# Altium project Ai-WB2-01S推荐封装.PrjPcb
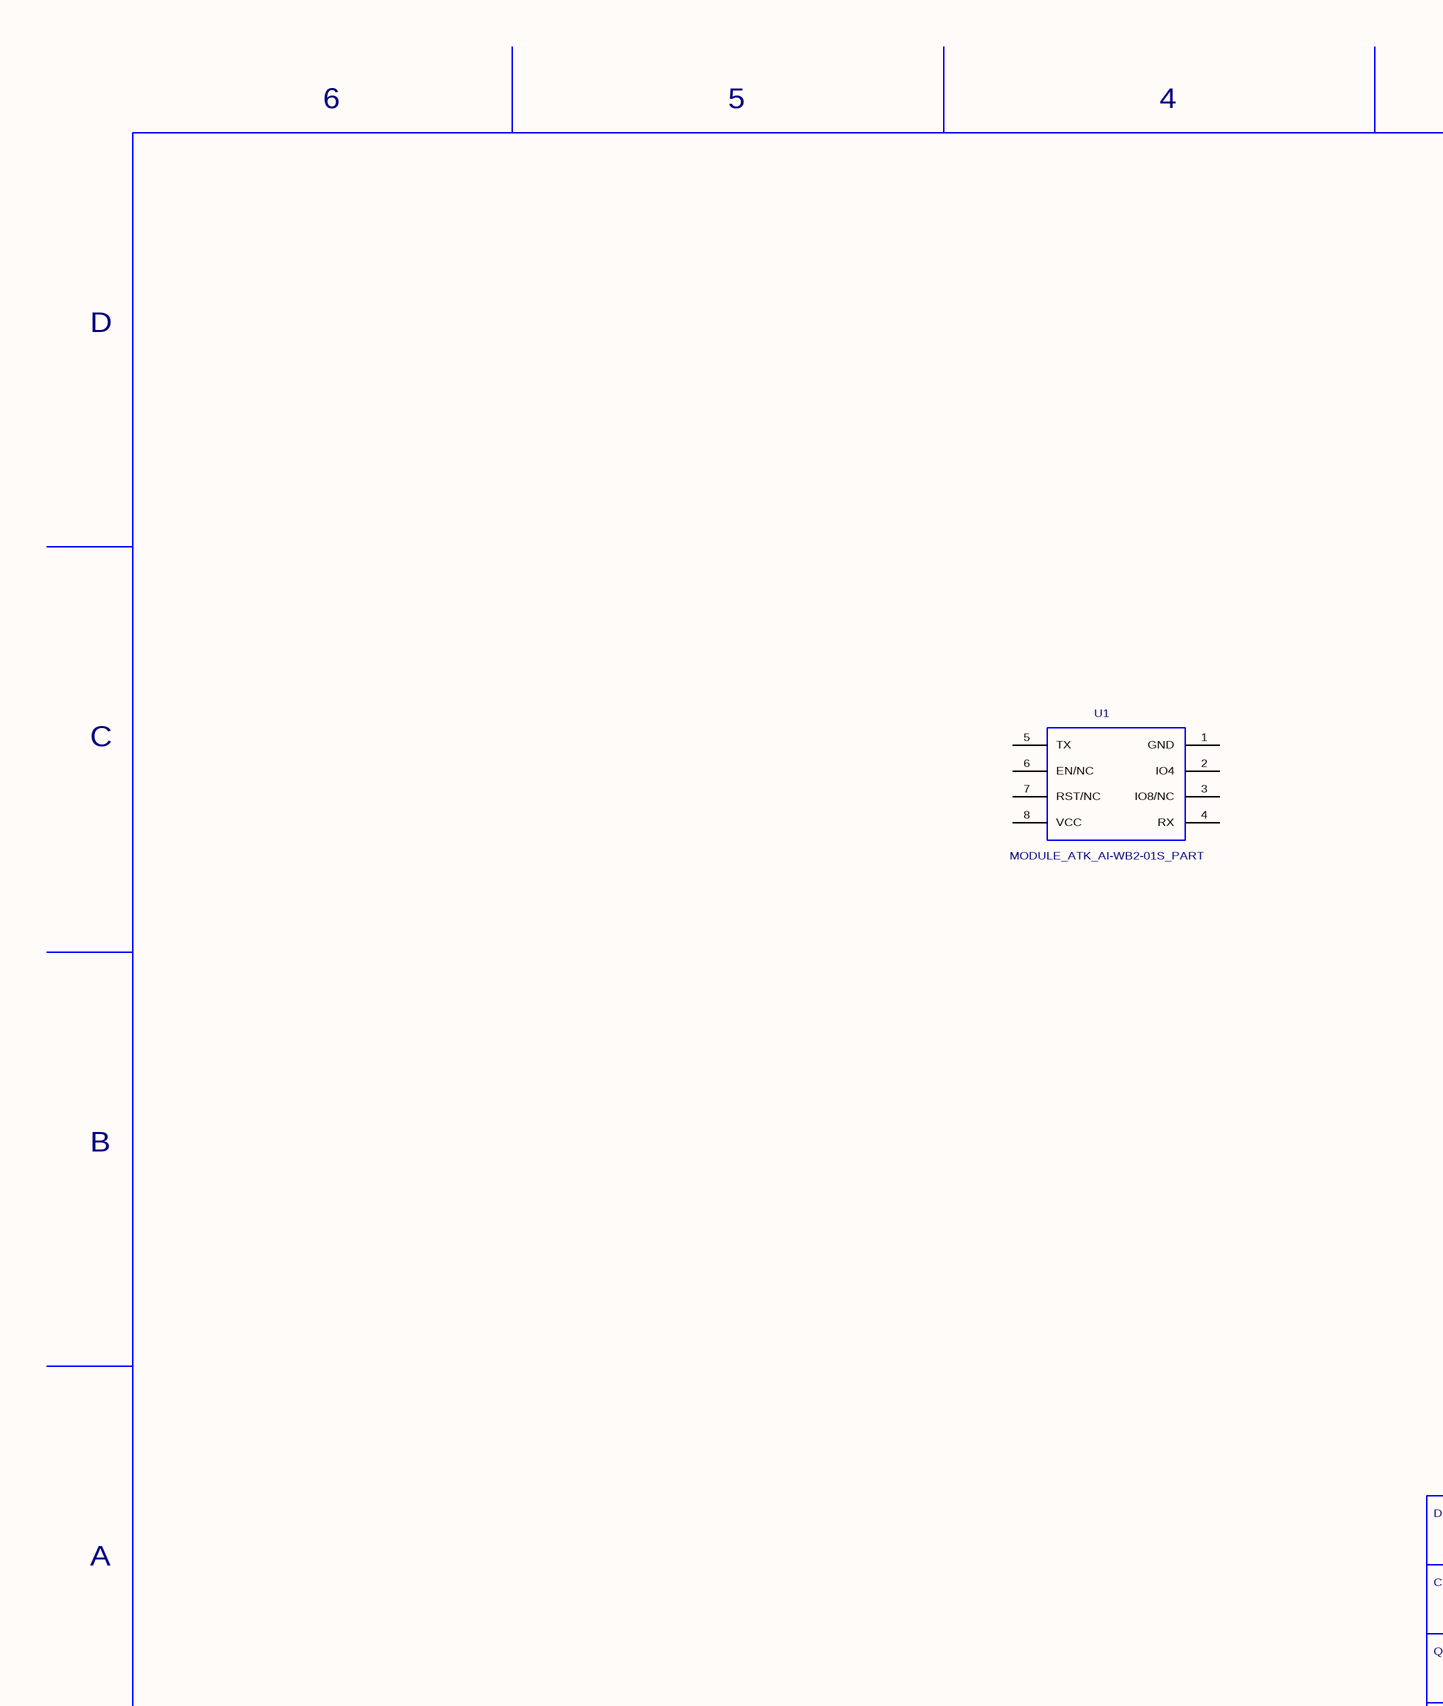
[diagram p0: Ai-WB2-01S推荐封装.Sheet 1.SchDoc, left]
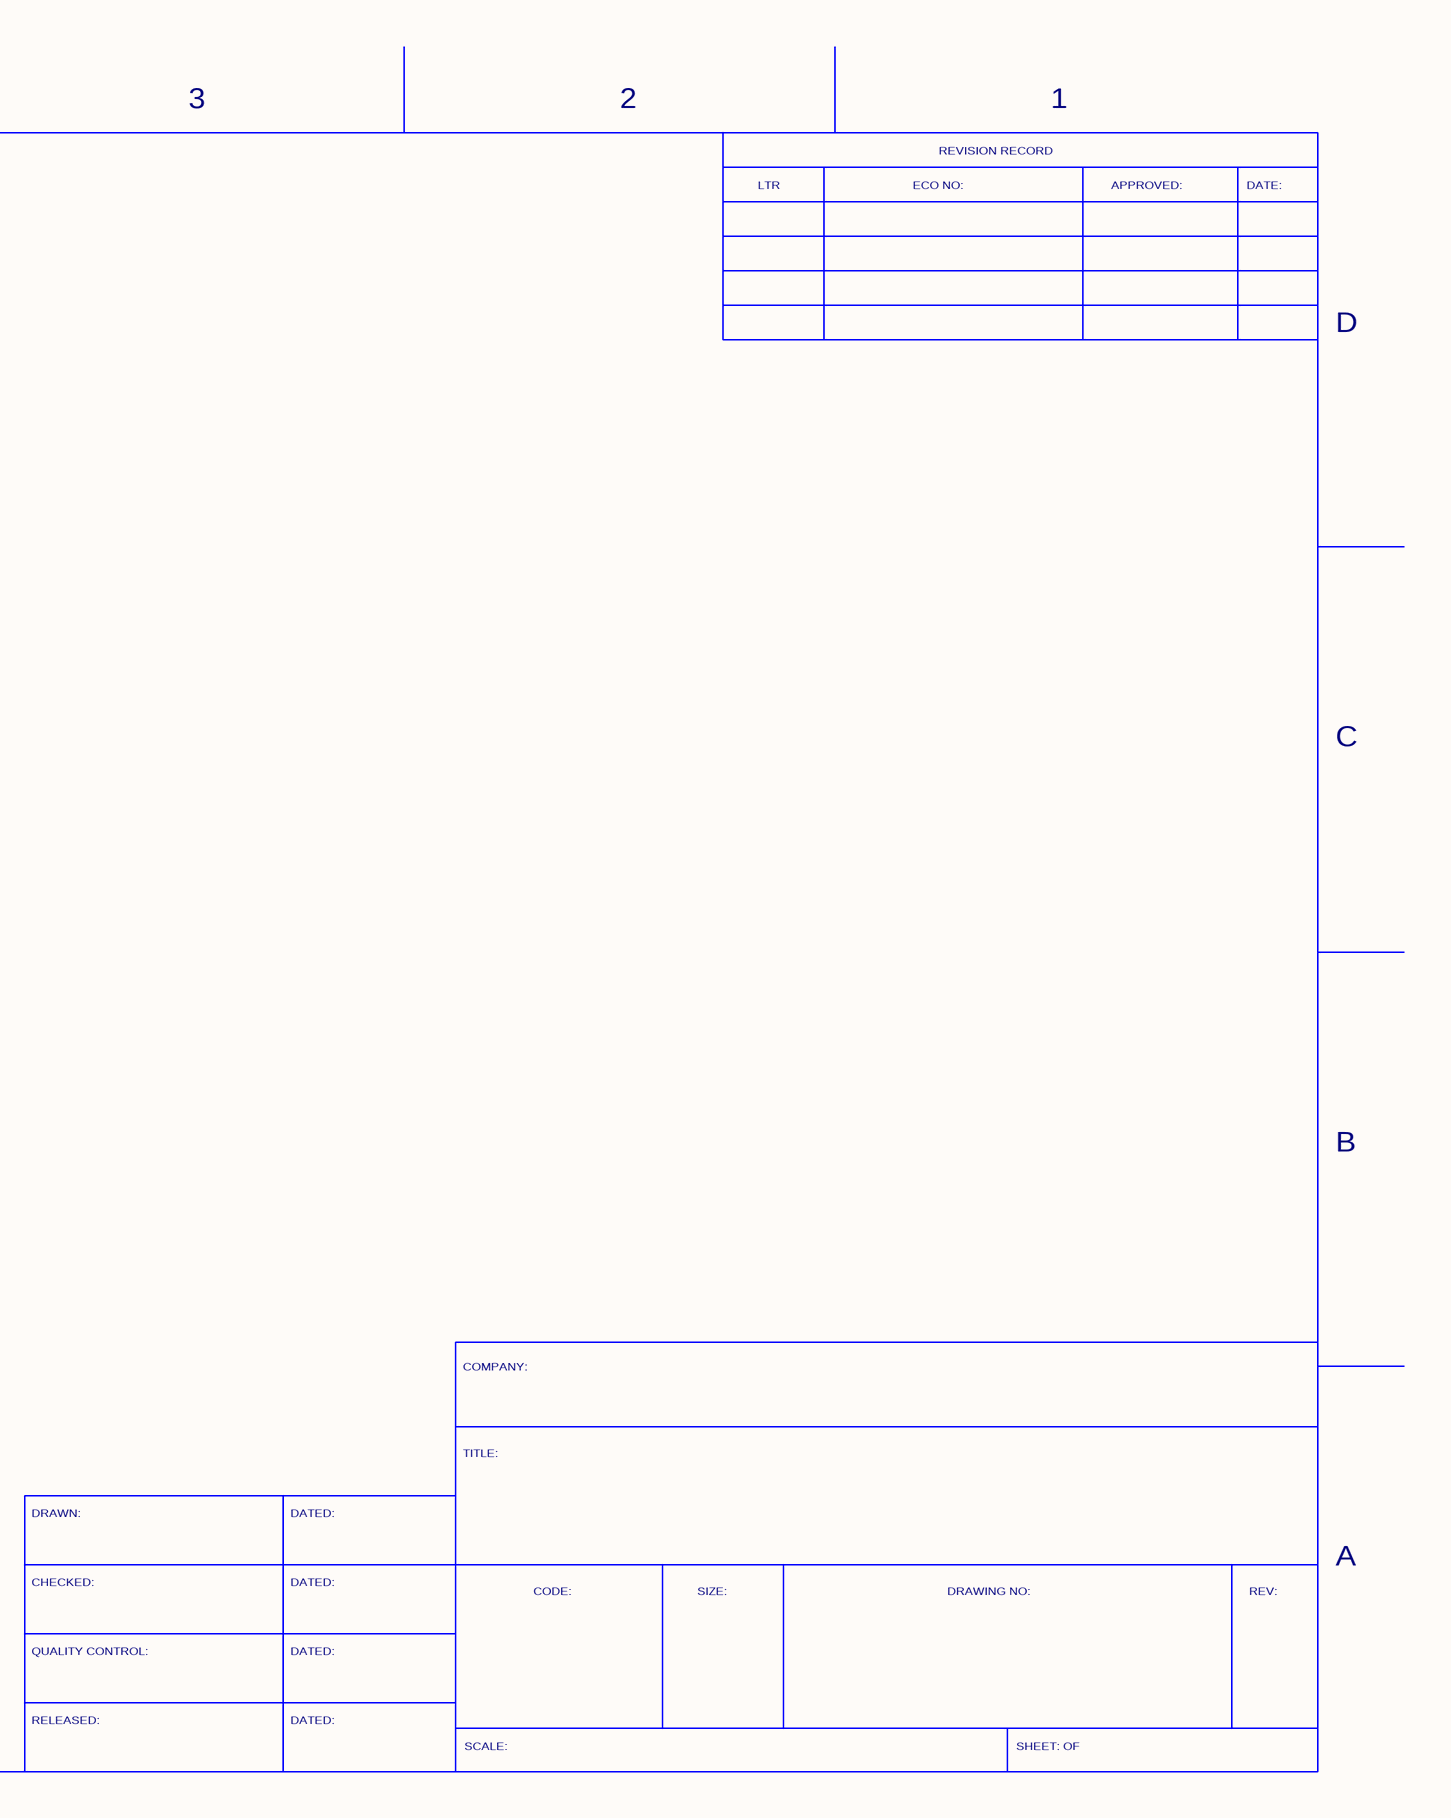
[diagram p1: Ai-WB2-01S推荐封装.Sheet 1.SchDoc, right]
1 sheet, 1 parts. Net scope: global (net labels, ports and power ports of the same name join across sheets).
Board files: Ai-WB2-01S推荐封装.PcbDoc, Ai-WB2-01S_modified.PcbDoc

## Sheet Ai-WB2-01S推荐封装.Sheet 1.SchDoc
size 431 x 279 mm; SchematicName: $$$NONE

### Parts
U1  MODULE_ATK_AI-WB2-01S_PART  [MODULE_ATK_AI-WB2-01S_PCB]

### Nets

Not connected (* = marked no-connect by the designer): U1 1(GND) 2(IO4) 3(IO8/NC) 4(RX) 5(TX) 6(EN/NC) 7(RST/NC) 8(VCC)

### Notes on the sheet
- 6
- 5
- 4
- 3
- 2
- REVISION RECORD
- 1
- LTR
- ECO NO:
- APPROVED:
- DATE:
- D
- C
- B
- COMPANY:
- TITLE:
- DRAWN:
- DATED:
- A
- CHECKED:
- CODE:
- SIZE:
- DRAWING NO:
- REV:
- QUALITY CONTROL:
- RELEASED:
- SCALE:
- SHEET: OF

### Library data of the parts
U1 = MODULE_ATK_AI-WB2-01S_PART: PCB DECAL: MODULE_ATK_AI-WB2-01S_PCB